# Altium schematic sheet ThermocoupleAmplifiersAD8497.SchDoc
size A
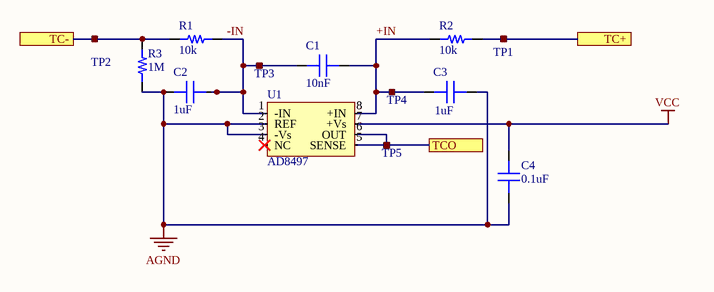
[diagram p0: ThermocoupleAmplifiersAD8497.SchDoc]

## Parts
C1  capacitance: 10nF  [0603]  (hidden comment: capacitor)
C2  capacitance: 1uF  [0603]  (hidden comment: capacitor)
C3  capacitance: 1uF  [0603]  (hidden comment: capacitor)
C4  capacitance: 0.1uF  [0603]  (hidden comment: capacitor)
R1  10k  [RES 0603/1608]
R2  10k  [RES 0603/1608]
R3  1M  [RES 0603/1608]
TP1  RCU-0C  [RCU-0C]  (value not drawn)
TP2  RCU-0C  [RCU-0C]  (value not drawn)
TP3  RCU-0C  [RCU-0C]  (value not drawn)
TP4  RCU-0C  [RCU-0C]  (value not drawn)
TP5  RCU-0C  [RCU-0C]  (value not drawn)
U1  AD8497  [MSOP-8]

## Ports
TC+, TC-, TCO

## Nets
AGND: C2.1 C3.2 C4.1 R3.1 U1.2(REF) U1.3(-Vs)
VCC: C4.2 U1.7(+Vs)
+IN: C1.2 C3.1 R2.1 TP4.1 U1.8(+IN)
-IN: C1.1 C2.2 R1.2 TP3.1 U1.1(-IN)
TC+: R2.2 TP1.1 ; port TC+
TC-: R1.1 R3.2 TP2.1 ; port TC-
TCO: TP5.1 U1.5(SENSE) U1.6(OUT) ; port TCO

Not connected (* = marked no-connect by the designer): U1 4(NC)*

## Library data of the parts
C1-C3 = 1: Generic 0603 capacitor; dielectric: Ceramic; ESR: 1; voltage: 50; percent tolerance: 10; name: 0603 Capacitor; package: 0603; id: 1; quantity: 0
C4 = 1: Generic 0603 capacitor; id: 1; voltage: 50; dielectric: Ceramic; percent tolerance: 10; name: 0603 Capacitor; ESR: 1; package: 0603; quantity: 0
R1-R3 = 1: name: 0603 Resistor; id: 1; percent tolerance: 5; package: 0603; quantity: 0
  R1 R2: resistance: 10k
  R3: resistance: 1M
TP1-TP5 = 14: id: 14; numcontacts: 1; name: RCU-0C; link: https://www.digikey.com/product-detail/en/te-connectivity-amp-connectors/RCU-0C/A106145CT-ND/3477802; numrows: 1; quantity: 0
U1 = 1: num_circuits: 1; gbw: 0; voltage: 15; link: https://www.digikey.com/product-detail/en/analog-devices-inc/AD8497ARMZ/AD8497ARMZ-ND/2404367; id: 1; slewrate: 0; currentoutput: 0; voltagelow: 0; voltagehigh: 0; quantity: 0